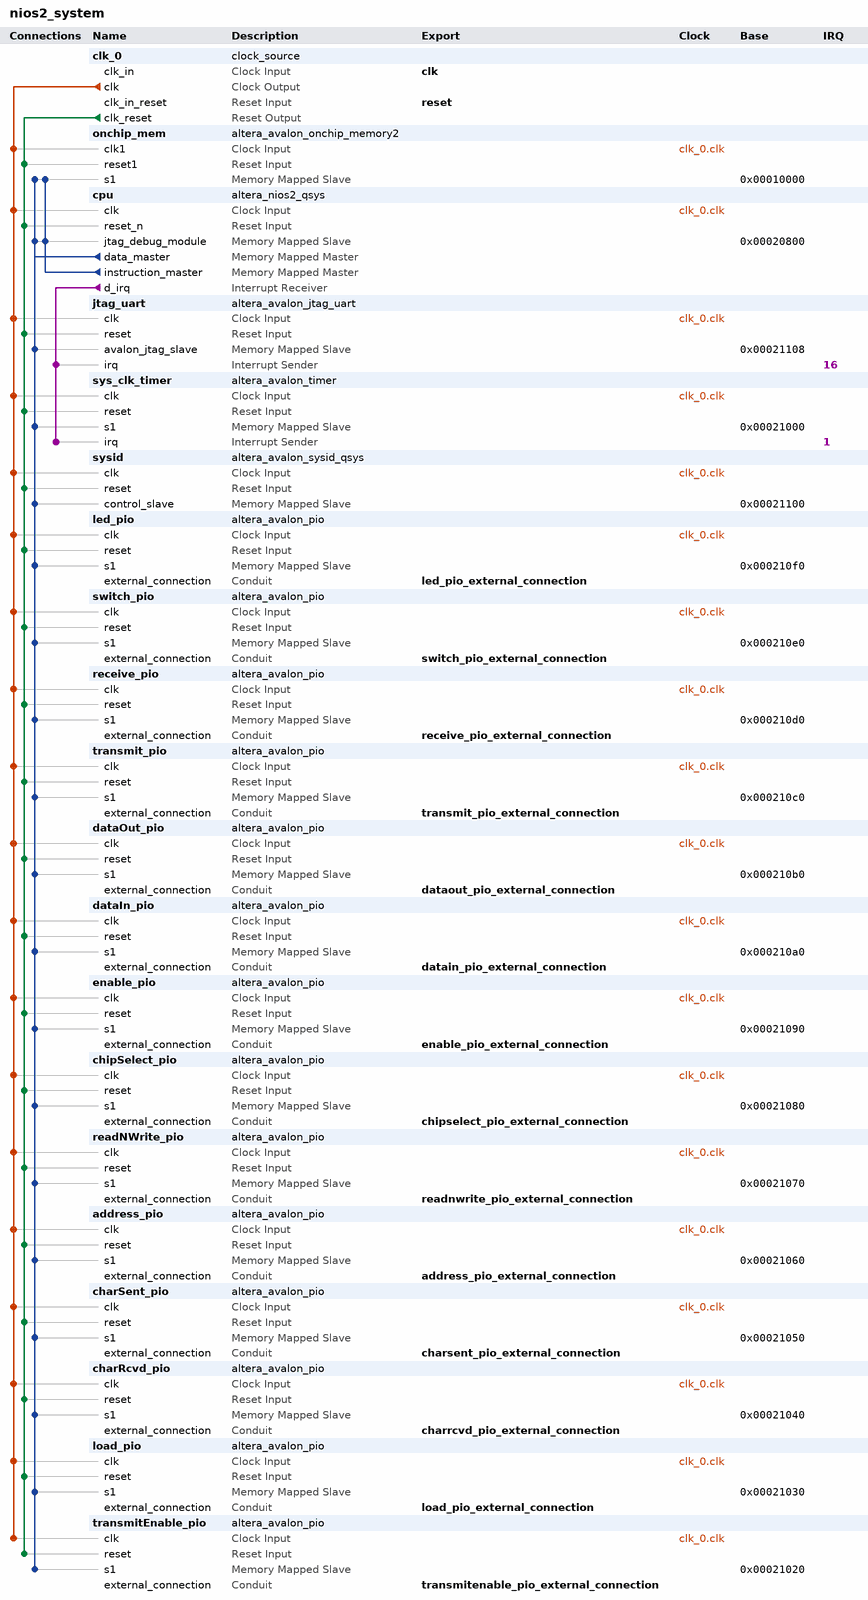
[diagram p0: system contents]
# Platform Designer (Qsys) system nios2_system, Cyclone V 5CSEMA5F31C6
# Parameters at their usual value, and those the tool derives, are not listed.
package require -exact qsys 15.1
create_system nios2_system
set_project_property DEVICE_FAMILY {Cyclone V}
set_project_property DEVICE 5CSEMA5F31C6

add_instance clk_0 clock_source 15.1
set_instance_parameter_value clk_0 clockFrequency 50000000

add_instance onchip_mem altera_avalon_onchip_memory2 15.1
set_instance_parameter_value onchip_mem dataWidth 32
set_instance_parameter_value onchip_mem dualPort false
set_instance_parameter_value onchip_mem initMemContent true
set_instance_parameter_value onchip_mem initializationFileName onchip_mem.hex
set_instance_parameter_value onchip_mem memorySize 40960

add_instance cpu altera_nios2_qsys 15.1
set_instance_parameter_value cpu breakSlave cpu.jtag_debug_module
set_instance_parameter_value cpu exceptionSlave onchip_mem.s1
set_instance_parameter_value cpu icache_size 2048
set_instance_parameter_value cpu impl Small
set_instance_parameter_value cpu mmu_TLBMissExcSlave None
set_instance_parameter_value cpu muldiv_multiplierType NoneSmall
set_instance_parameter_value cpu resetSlave onchip_mem.s1
set_instance_parameter_value cpu resetrequest_enabled true

add_instance jtag_uart altera_avalon_jtag_uart 15.1
set_instance_parameter_value jtag_uart simInteractiveOptions NO_INTERACTIVE_WINDOWS

add_instance sys_clk_timer altera_avalon_timer 15.1
set_instance_parameter_value sys_clk_timer period 1
set_instance_parameter_value sys_clk_timer periodUnits MSEC

add_instance sysid altera_avalon_sysid_qsys 15.1
set_instance_parameter_value sysid id 0

add_instance led_pio altera_avalon_pio 15.1
set_instance_parameter_value led_pio direction Output
set_instance_parameter_value led_pio width 8

add_instance switch_pio altera_avalon_pio 15.1
set_instance_parameter_value switch_pio direction Input
set_instance_parameter_value switch_pio width 8

add_instance receive_pio altera_avalon_pio 15.1
set_instance_parameter_value receive_pio direction Input
set_instance_parameter_value receive_pio width 8

add_instance transmit_pio altera_avalon_pio 15.1
set_instance_parameter_value transmit_pio direction Output
set_instance_parameter_value transmit_pio width 8

add_instance dataOut_pio altera_avalon_pio 15.1
set_instance_parameter_value dataOut_pio direction Output
set_instance_parameter_value dataOut_pio width 8

add_instance dataIn_pio altera_avalon_pio 15.1
set_instance_parameter_value dataIn_pio direction Input
set_instance_parameter_value dataIn_pio width 8

add_instance enable_pio altera_avalon_pio 15.1
set_instance_parameter_value enable_pio direction Output
set_instance_parameter_value enable_pio width 1

add_instance chipSelect_pio altera_avalon_pio 15.1
set_instance_parameter_value chipSelect_pio direction Output
set_instance_parameter_value chipSelect_pio width 1

add_instance readNWrite_pio altera_avalon_pio 15.1
set_instance_parameter_value readNWrite_pio direction Output
set_instance_parameter_value readNWrite_pio width 1

add_instance address_pio altera_avalon_pio 15.1
set_instance_parameter_value address_pio direction Output
set_instance_parameter_value address_pio width 11

add_instance charSent_pio altera_avalon_pio 15.1
set_instance_parameter_value charSent_pio direction Input
set_instance_parameter_value charSent_pio width 1

add_instance charRcvd_pio altera_avalon_pio 15.1
set_instance_parameter_value charRcvd_pio direction Input
set_instance_parameter_value charRcvd_pio width 1

add_instance load_pio altera_avalon_pio 15.1
set_instance_parameter_value load_pio direction Output
set_instance_parameter_value load_pio width 1

add_instance transmitEnable_pio altera_avalon_pio 15.1
set_instance_parameter_value transmitEnable_pio direction Output
set_instance_parameter_value transmitEnable_pio width 1

# connections
add_connection clk_0.clk address_pio.clk clock
add_connection clk_0.clk charRcvd_pio.clk clock
add_connection clk_0.clk charSent_pio.clk clock
add_connection clk_0.clk chipSelect_pio.clk clock
add_connection clk_0.clk cpu.clk clock
add_connection clk_0.clk dataIn_pio.clk clock
add_connection clk_0.clk dataOut_pio.clk clock
add_connection clk_0.clk enable_pio.clk clock
add_connection clk_0.clk jtag_uart.clk clock
add_connection clk_0.clk led_pio.clk clock
add_connection clk_0.clk load_pio.clk clock
add_connection clk_0.clk onchip_mem.clk1 clock
add_connection clk_0.clk readNWrite_pio.clk clock
add_connection clk_0.clk receive_pio.clk clock
add_connection clk_0.clk switch_pio.clk clock
add_connection clk_0.clk sys_clk_timer.clk clock
add_connection clk_0.clk sysid.clk clock
add_connection clk_0.clk transmit_pio.clk clock
add_connection clk_0.clk transmitEnable_pio.clk clock
add_connection clk_0.clk_reset address_pio.reset reset
add_connection clk_0.clk_reset charRcvd_pio.reset reset
add_connection clk_0.clk_reset charSent_pio.reset reset
add_connection clk_0.clk_reset chipSelect_pio.reset reset
add_connection clk_0.clk_reset cpu.reset_n reset
add_connection clk_0.clk_reset dataIn_pio.reset reset
add_connection clk_0.clk_reset dataOut_pio.reset reset
add_connection clk_0.clk_reset enable_pio.reset reset
add_connection clk_0.clk_reset jtag_uart.reset reset
add_connection clk_0.clk_reset led_pio.reset reset
add_connection clk_0.clk_reset load_pio.reset reset
add_connection clk_0.clk_reset onchip_mem.reset1 reset
add_connection clk_0.clk_reset readNWrite_pio.reset reset
add_connection clk_0.clk_reset receive_pio.reset reset
add_connection clk_0.clk_reset switch_pio.reset reset
add_connection clk_0.clk_reset sys_clk_timer.reset reset
add_connection clk_0.clk_reset sysid.reset reset
add_connection clk_0.clk_reset transmit_pio.reset reset
add_connection clk_0.clk_reset transmitEnable_pio.reset reset
add_connection cpu.data_master address_pio.s1 avalon
set_connection_parameter_value cpu.data_master/address_pio.s1 baseAddress 0x00021060
add_connection cpu.data_master charRcvd_pio.s1 avalon
set_connection_parameter_value cpu.data_master/charRcvd_pio.s1 baseAddress 0x00021040
add_connection cpu.data_master charSent_pio.s1 avalon
set_connection_parameter_value cpu.data_master/charSent_pio.s1 baseAddress 0x00021050
add_connection cpu.data_master chipSelect_pio.s1 avalon
set_connection_parameter_value cpu.data_master/chipSelect_pio.s1 baseAddress 0x00021080
add_connection cpu.data_master cpu.jtag_debug_module avalon
set_connection_parameter_value cpu.data_master/cpu.jtag_debug_module baseAddress 0x00020800
add_connection cpu.data_master dataIn_pio.s1 avalon
set_connection_parameter_value cpu.data_master/dataIn_pio.s1 baseAddress 0x000210a0
add_connection cpu.data_master dataOut_pio.s1 avalon
set_connection_parameter_value cpu.data_master/dataOut_pio.s1 baseAddress 0x000210b0
add_connection cpu.data_master enable_pio.s1 avalon
set_connection_parameter_value cpu.data_master/enable_pio.s1 baseAddress 0x00021090
add_connection cpu.data_master jtag_uart.avalon_jtag_slave avalon
set_connection_parameter_value cpu.data_master/jtag_uart.avalon_jtag_slave baseAddress 0x00021108
add_connection cpu.data_master led_pio.s1 avalon
set_connection_parameter_value cpu.data_master/led_pio.s1 baseAddress 0x000210f0
add_connection cpu.data_master load_pio.s1 avalon
set_connection_parameter_value cpu.data_master/load_pio.s1 baseAddress 0x00021030
add_connection cpu.data_master onchip_mem.s1 avalon
set_connection_parameter_value cpu.data_master/onchip_mem.s1 baseAddress 0x00010000
add_connection cpu.data_master readNWrite_pio.s1 avalon
set_connection_parameter_value cpu.data_master/readNWrite_pio.s1 baseAddress 0x00021070
add_connection cpu.data_master receive_pio.s1 avalon
set_connection_parameter_value cpu.data_master/receive_pio.s1 baseAddress 0x000210d0
add_connection cpu.data_master switch_pio.s1 avalon
set_connection_parameter_value cpu.data_master/switch_pio.s1 baseAddress 0x000210e0
add_connection cpu.data_master sys_clk_timer.s1 avalon
set_connection_parameter_value cpu.data_master/sys_clk_timer.s1 baseAddress 0x00021000
add_connection cpu.data_master sysid.control_slave avalon
set_connection_parameter_value cpu.data_master/sysid.control_slave baseAddress 0x00021100
add_connection cpu.data_master transmit_pio.s1 avalon
set_connection_parameter_value cpu.data_master/transmit_pio.s1 baseAddress 0x000210c0
add_connection cpu.data_master transmitEnable_pio.s1 avalon
set_connection_parameter_value cpu.data_master/transmitEnable_pio.s1 baseAddress 0x00021020
add_connection cpu.instruction_master cpu.jtag_debug_module avalon
set_connection_parameter_value cpu.instruction_master/cpu.jtag_debug_module baseAddress 0x00020800
add_connection cpu.instruction_master onchip_mem.s1 avalon
set_connection_parameter_value cpu.instruction_master/onchip_mem.s1 baseAddress 0x00010000
add_connection cpu.d_irq jtag_uart.irq interrupt
set_connection_parameter_value cpu.d_irq/jtag_uart.irq irqNumber 16
add_connection cpu.d_irq sys_clk_timer.irq interrupt
set_connection_parameter_value cpu.d_irq/sys_clk_timer.irq irqNumber 1

# exported interfaces
add_interface address_pio_external_connection conduit end
set_interface_property address_pio_external_connection EXPORT_OF address_pio.external_connection
add_interface charrcvd_pio_external_connection conduit end
set_interface_property charrcvd_pio_external_connection EXPORT_OF charRcvd_pio.external_connection
add_interface charsent_pio_external_connection conduit end
set_interface_property charsent_pio_external_connection EXPORT_OF charSent_pio.external_connection
add_interface chipselect_pio_external_connection conduit end
set_interface_property chipselect_pio_external_connection EXPORT_OF chipSelect_pio.external_connection
add_interface clk clock sink
set_interface_property clk EXPORT_OF clk_0.clk_in
add_interface datain_pio_external_connection conduit end
set_interface_property datain_pio_external_connection EXPORT_OF dataIn_pio.external_connection
add_interface dataout_pio_external_connection conduit end
set_interface_property dataout_pio_external_connection EXPORT_OF dataOut_pio.external_connection
add_interface enable_pio_external_connection conduit end
set_interface_property enable_pio_external_connection EXPORT_OF enable_pio.external_connection
add_interface led_pio_external_connection conduit end
set_interface_property led_pio_external_connection EXPORT_OF led_pio.external_connection
add_interface load_pio_external_connection conduit end
set_interface_property load_pio_external_connection EXPORT_OF load_pio.external_connection
add_interface readnwrite_pio_external_connection conduit end
set_interface_property readnwrite_pio_external_connection EXPORT_OF readNWrite_pio.external_connection
add_interface receive_pio_external_connection conduit end
set_interface_property receive_pio_external_connection EXPORT_OF receive_pio.external_connection
add_interface reset reset sink
set_interface_property reset EXPORT_OF clk_0.clk_in_reset
add_interface switch_pio_external_connection conduit end
set_interface_property switch_pio_external_connection EXPORT_OF switch_pio.external_connection
add_interface transmit_pio_external_connection conduit end
set_interface_property transmit_pio_external_connection EXPORT_OF transmit_pio.external_connection
add_interface transmitenable_pio_external_connection conduit end
set_interface_property transmitenable_pio_external_connection EXPORT_OF transmitEnable_pio.external_connection

set_interconnect_requirement {$system} qsys_mm.clockCrossingAdapter HANDSHAKE
set_interconnect_requirement {$system} qsys_mm.enableEccProtection FALSE
set_interconnect_requirement {$system} qsys_mm.insertDefaultSlave FALSE
set_interconnect_requirement {$system} qsys_mm.maxAdditionalLatency 1

save_system nios2_system.qsys
